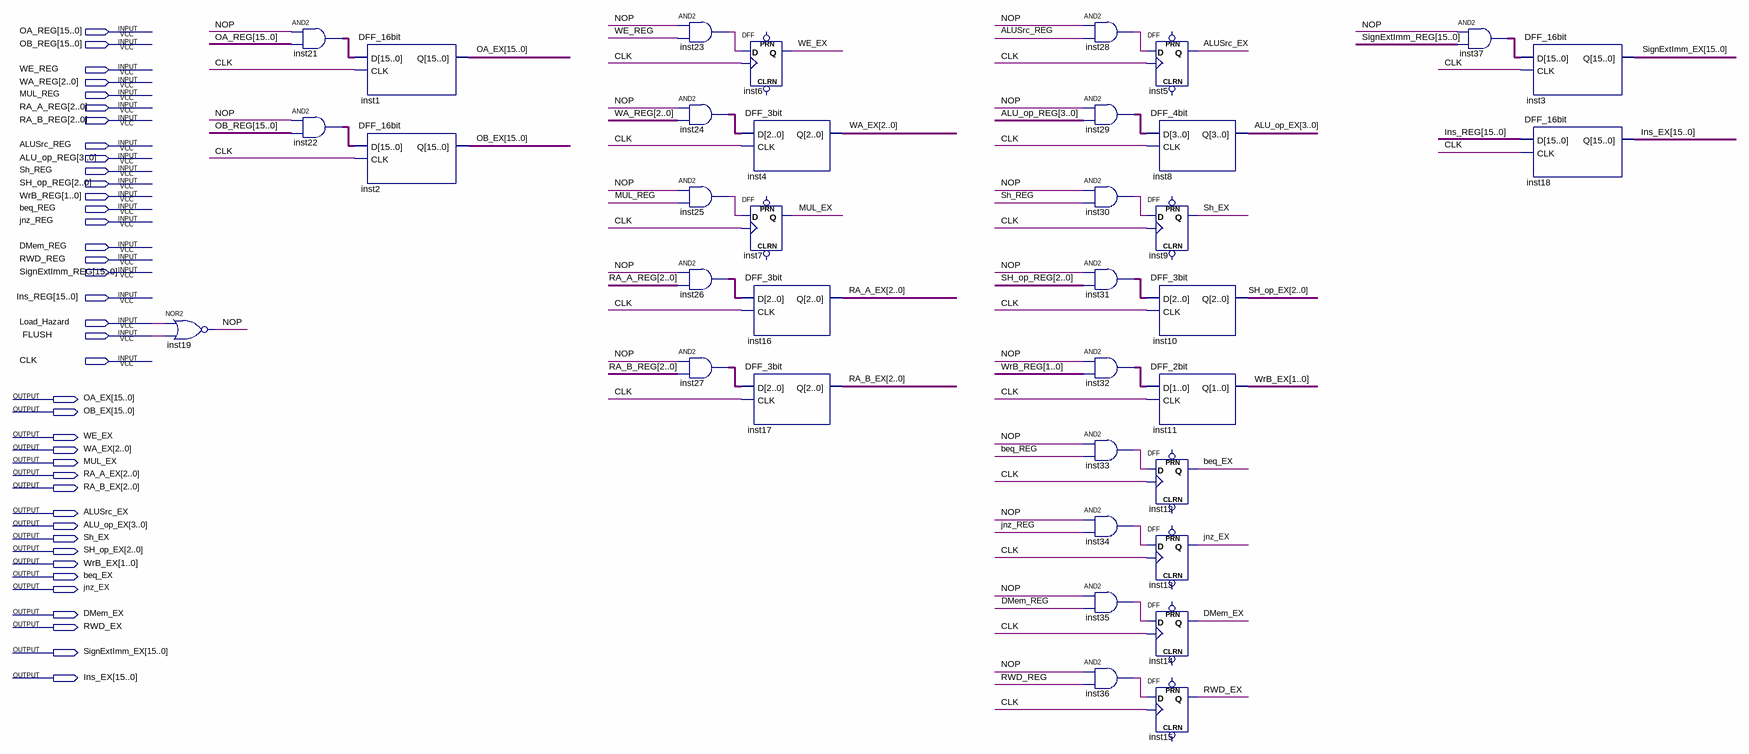
[diagram p0: schematic sheet]
// Quartus schematic REG_EX.bdf as structural Verilog: 36 symbols, 39 pins
module REG_EX (
  input  [15:0] OA_REG,
  input  [15:0] OB_REG,
  input  WE_REG,
  input  [2:0] WA_REG,
  input  MUL_REG,
  input  [2:0] RA_A_REG,
  input  [2:0] RA_B_REG,
  input  ALUSrc_REG,
  input  [3:0] ALU_op_REG,
  input  Sh_REG,
  input  [2:0] SH_op_REG,
  input  [1:0] WrB_REG,
  input  beq_REG,
  input  jnz_REG,
  input  DMem_REG,
  input  RWD_REG,
  input  [15:0] SignExtImm_REG,
  input  [15:0] Ins_REG,
  input  Load_Hazard,
  input  FLUSH,
  input  CLK,
  output [15:0] OA_EX,
  output [15:0] OB_EX,
  output WE_EX,
  output [2:0] WA_EX,
  output MUL_EX,
  output [2:0] RA_A_EX,
  output [2:0] RA_B_EX,
  output ALUSrc_EX,
  output [3:0] ALU_op_EX,
  output Sh_EX,
  output [2:0] SH_op_EX,
  output [1:0] WrB_EX,
  output beq_EX,
  output jnz_EX,
  output DMem_EX,
  output RWD_EX,
  output [15:0] SignExtImm_EX,
  output [15:0] Ins_EX
);

  wire inst23_out, inst25_out, inst28_out, inst30_out, inst33_out, inst34_out, inst35_out, inst36_out, NOP;
  wire [1:0] inst32_out;
  wire [2:0] inst24_out, inst26_out, inst27_out, inst31_out;
  wire [3:0] inst29_out;
  wire [15:0] inst21_out, inst22_out, inst37_out;

  nor inst19 (NOP, Load_Hazard, FLUSH);
  assign inst21_out = {16{NOP}} & OA_REG;  // AND2 inst21, 16 bits wide
  assign inst22_out = {16{NOP}} & OB_REG;  // AND2 inst22, 16 bits wide
  DFF_16bit inst1 (.D(inst21_out), .CLK(CLK), .Q(OA_EX));
  DFF_16bit inst2 (.D(inst22_out), .CLK(CLK), .Q(OB_EX));
  and inst23 (inst23_out, NOP, WE_REG);
  assign inst24_out = {3{NOP}} & WA_REG;  // AND2 inst24, 3 bits wide
  and inst25 (inst25_out, NOP, MUL_REG);
  assign inst26_out = {3{NOP}} & RA_A_REG;  // AND2 inst26, 3 bits wide
  assign inst27_out = {3{NOP}} & RA_B_REG;  // AND2 inst27, 3 bits wide
  DFF inst6 (.CLK(CLK), .D(inst23_out), .Q(WE_EX));  // open: CLRN, PRN
  DFF_3bit inst4 (.D(inst24_out), .CLK(CLK), .Q(WA_EX));
  DFF inst7 (.CLK(CLK), .D(inst25_out), .Q(MUL_EX));  // open: CLRN, PRN
  DFF_3bit inst16 (.D(inst26_out), .CLK(CLK), .Q(RA_A_EX));
  DFF_3bit inst17 (.D(inst27_out), .CLK(CLK), .Q(RA_B_EX));
  and inst28 (inst28_out, NOP, ALUSrc_REG);
  assign inst29_out = {4{NOP}} & ALU_op_REG;  // AND2 inst29, 4 bits wide
  and inst30 (inst30_out, NOP, Sh_REG);
  assign inst31_out = {3{NOP}} & SH_op_REG;  // AND2 inst31, 3 bits wide
  assign inst32_out = {2{NOP}} & WrB_REG;  // AND2 inst32, 2 bits wide
  and inst33 (inst33_out, NOP, beq_REG);
  and inst34 (inst34_out, NOP, jnz_REG);
  and inst35 (inst35_out, NOP, DMem_REG);
  and inst36 (inst36_out, NOP, RWD_REG);
  DFF inst5 (.CLK(CLK), .D(inst28_out), .Q(ALUSrc_EX));  // open: CLRN, PRN
  DFF_4bit inst8 (.D(inst29_out), .CLK(CLK), .Q(ALU_op_EX));
  DFF inst9 (.CLK(CLK), .D(inst30_out), .Q(Sh_EX));  // open: CLRN, PRN
  DFF_3bit inst10 (.D(inst31_out), .CLK(CLK), .Q(SH_op_EX));
  DFF_2bit inst11 (.D(inst32_out), .CLK(CLK), .Q(WrB_EX));
  DFF inst12 (.CLK(CLK), .D(inst33_out), .Q(beq_EX));  // open: CLRN, PRN
  DFF inst13 (.CLK(CLK), .D(inst34_out), .Q(jnz_EX));  // open: CLRN, PRN
  DFF inst14 (.CLK(CLK), .D(inst35_out), .Q(DMem_EX));  // open: CLRN, PRN
  DFF inst15 (.CLK(CLK), .D(inst36_out), .Q(RWD_EX));  // open: CLRN, PRN
  assign inst37_out = {16{NOP}} & SignExtImm_REG;  // AND2 inst37, 16 bits wide
  DFF_16bit inst3 (.D(inst37_out), .CLK(CLK), .Q(SignExtImm_EX));
  DFF_16bit inst18 (.D(Ins_REG), .CLK(CLK), .Q(Ins_EX));
endmodule
